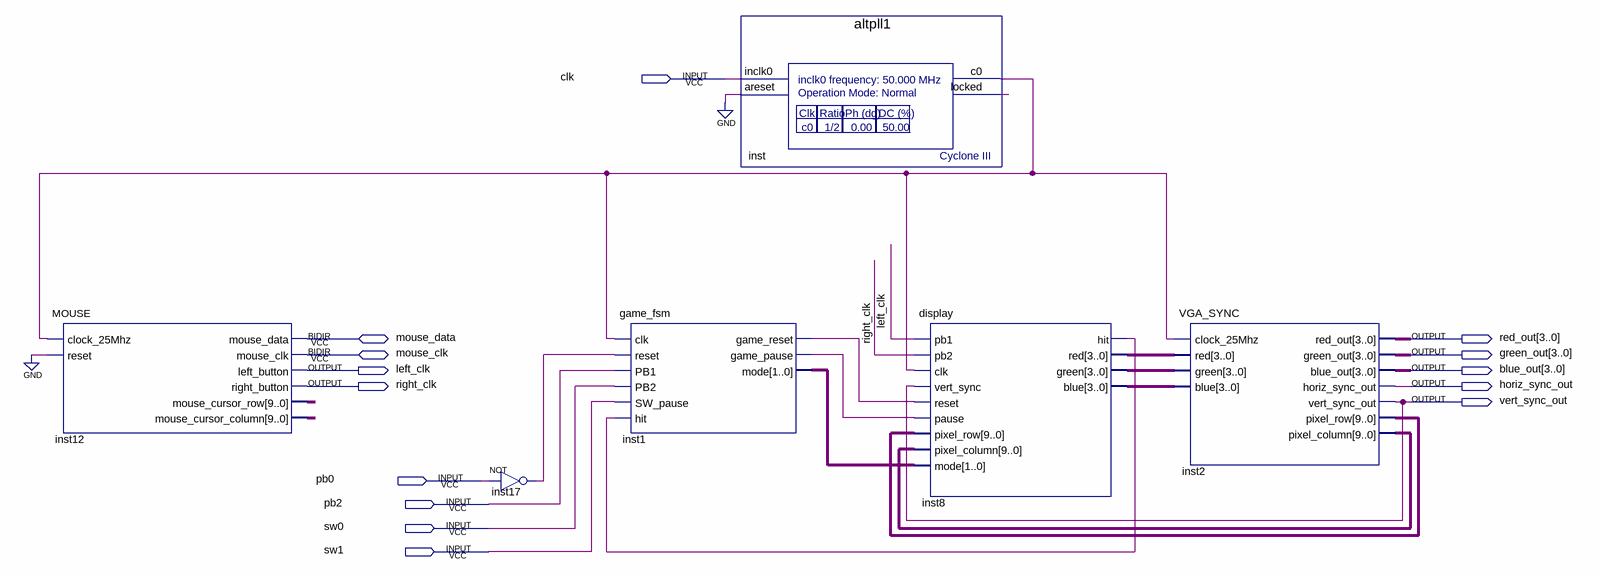
[diagram p0: schematic sheet]
// Quartus schematic MiniProject.bdf as structural Verilog: 6 symbols, 14 pins
module MiniProject (
  input  clk,
  input  pb0,
  input  pb2,
  input  sw0,
  input  sw1,
  inout  mouse_data,
  inout  mouse_clk,
  output [3:0] red_out,
  output [3:0] green_out,
  output left_clk,
  output [3:0] blue_out,
  output right_clk,
  output horiz_sync_out,
  output vert_sync_out
);

  wire inst1_game_pause, inst1_game_reset, inst8_hit, inst17_out, inst_c0, inst_locked;
  wire [1:0] inst1_mode;
  wire [3:0] inst8_blue, inst8_green, inst8_red;
  wire [9:0] inst2_pixel_column, inst2_pixel_row, inst12_mouse_cursor_column, inst12_mouse_cursor_row;

  MOUSE inst12 (
    .clock_25Mhz(inst_c0), .reset(1'b0), .left_button(left_clk), .right_button(right_clk),
    .mouse_cursor_row(inst12_mouse_cursor_row), .mouse_cursor_column(inst12_mouse_cursor_column),
    .mouse_data(mouse_data), .mouse_clk(mouse_clk));
  not inst17 (inst17_out, pb0);
  game_fsm inst1 (
    .clk(inst_c0), .reset(inst17_out), .PB1(pb2), .PB2(sw0), .SW_pause(sw1), .hit(inst8_hit),
    .game_reset(inst1_game_reset), .game_pause(inst1_game_pause), .mode(inst1_mode));
  altpll1 inst (.inclk0(clk), .areset(1'b0), .c0(inst_c0), .locked(inst_locked));
  display inst8 (
    .pb1(left_clk), .pb2(right_clk), .clk(inst_c0), .vert_sync(vert_sync_out), .reset(inst1_game_reset),
    .pause(inst1_game_pause), .pixel_row(inst2_pixel_row), .pixel_column(inst2_pixel_column),
    .mode(inst1_mode), .hit(inst8_hit), .red(inst8_red), .green(inst8_green), .blue(inst8_blue));
  VGA_SYNC inst2 (
    .clock_25Mhz(inst_c0), .red(inst8_red), .green(inst8_green), .blue(inst8_blue), .red_out(red_out),
    .green_out(green_out), .blue_out(blue_out), .horiz_sync_out(horiz_sync_out),
    .vert_sync_out(vert_sync_out), .pixel_row(inst2_pixel_row), .pixel_column(inst2_pixel_column));
endmodule
